# EAGLE schematic analog_pitch_board (EAGLE 9.6.2)
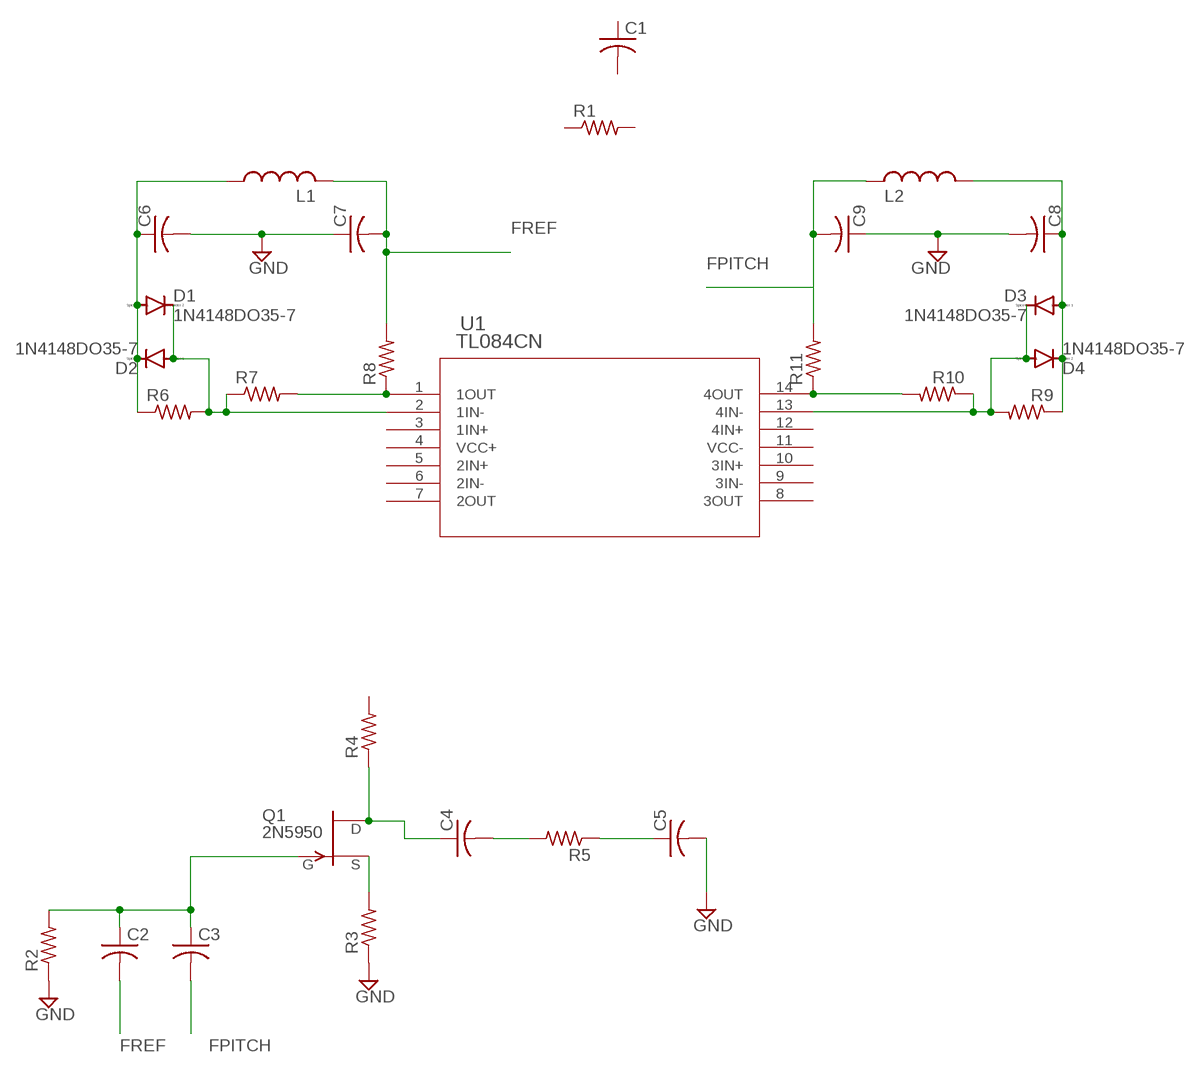
[diagram p0: schematic, sheet 1]

## Parts
C1  C-US025-024X044  [C025-024X044]
C2  C-US025-024X044  [C025-024X044]
C3  C-US025-024X044  [C025-024X044]
C4  C-US025-024X044  [C025-024X044]
C5  C-US025-024X044  [C025-024X044]
C6  C-US025-024X044  [C025-024X044]
C7  C-US025-024X044  [C025-024X044]
C8  C-US025-024X044  [C025-024X044]
C9  C-US025-024X044  [C025-024X044]
D1  1N4148DO35-7  [DO35-7]
D2  1N4148DO35-7  [DO35-7]
D3  1N4148DO35-7  [DO35-7]
D4  1N4148DO35-7  [DO35-7]
L1  L-US6000-XXX-RC  [6000-XXXX-RC]
L2  L-US6000-XXX-RC  [6000-XXXX-RC]
Q1  2N5950  [TO-92]
R1  R-US_0207/10  [0207/10]
R2  R-US_0207/10  [0207/10]
R3  R-US_0207/10  [0207/10]
R4  R-US_0207/10  [0207/10]
R5  R-US_0207/10  [0207/10]
R6  R-US_0207/10  [0207/10]
R7  R-US_0207/10  [0207/10]
R8  R-US_0207/10  [0207/10]
R9  R-US_0207/10  [0207/10]
R10  R-US_0207/10  [0207/10]
R11  R-US_0207/10  [0207/10]
U1  TL084CN  [N14]

## Nets
FPITCH: C3.2 C9.2 L2.2 R11.2
FREF: C2.2 C7.2 L1.2 R8.2
GND: C5.2 C6.2 C7.1 C8.2 C9.1 R2.1 R3.1
N$1: C2.1 C3.1 Q1.1(G) R2.2
N$2: C4.1 Q1.3(D) R4.1
N$3: C4.2 R5.2
N$4: C5.1 R5.1
N$5: R7.2 R8.1 U1.1(1OUT)
N$6: Q1.2(S) R3.2
N$8: C6.1 D1.A D2.C L1.1 R6.1
N$9: D1.C D2.A R6.2 R7.1 U1.2(1IN-)
N$11: R10.2 R11.1 U1.14(4OUT)
N$12: C8.1 D3.A D4.C L2.1 R9.1
N$13: D3.C D4.A R9.2 R10.1 U1.13(4IN-)
Unconnected: C1.1 C1.2 R1.1 R1.2 R4.2 U1.3(1IN+) U1.5(2IN+) U1.6(2IN-) U1.7(2OUT) U1.8(3OUT) U1.9(3IN-) U1.10(3IN+) U1.12(4IN+)

## Power pins joined to a net without a drawn wire
VCC+: U1.4(VCC+)
VCC-: U1.11(VCC-)

## Library data of the parts
C1-C9 = rcl:C-US: CAPACITOR, American symbol; SPICEPREFIX: C
D1-D4 = diode:1N4148: DIODE high speed (Philips)
L1 L2 = rcl:L-US: INDUCTOR, American symbol; SPICEPREFIX: L
Q1 = transistor-fet:2N5950: N-Channel JFET RF Amplifier
R1-R11 = rcl:R-US_: RESISTOR, American symbol; SPICEPREFIX: R
U1 = theremin:TL084CN; COPYRIGHT: Copyright (C) 2025 Ultra Librarian. All rights reserved.; MANUFACTURER_PART_NUMBER: TL084CN; MFR_NAME: Texas Instruments